# EAGLE schematic PumpMonitoring (EAGLE 7.6.0)
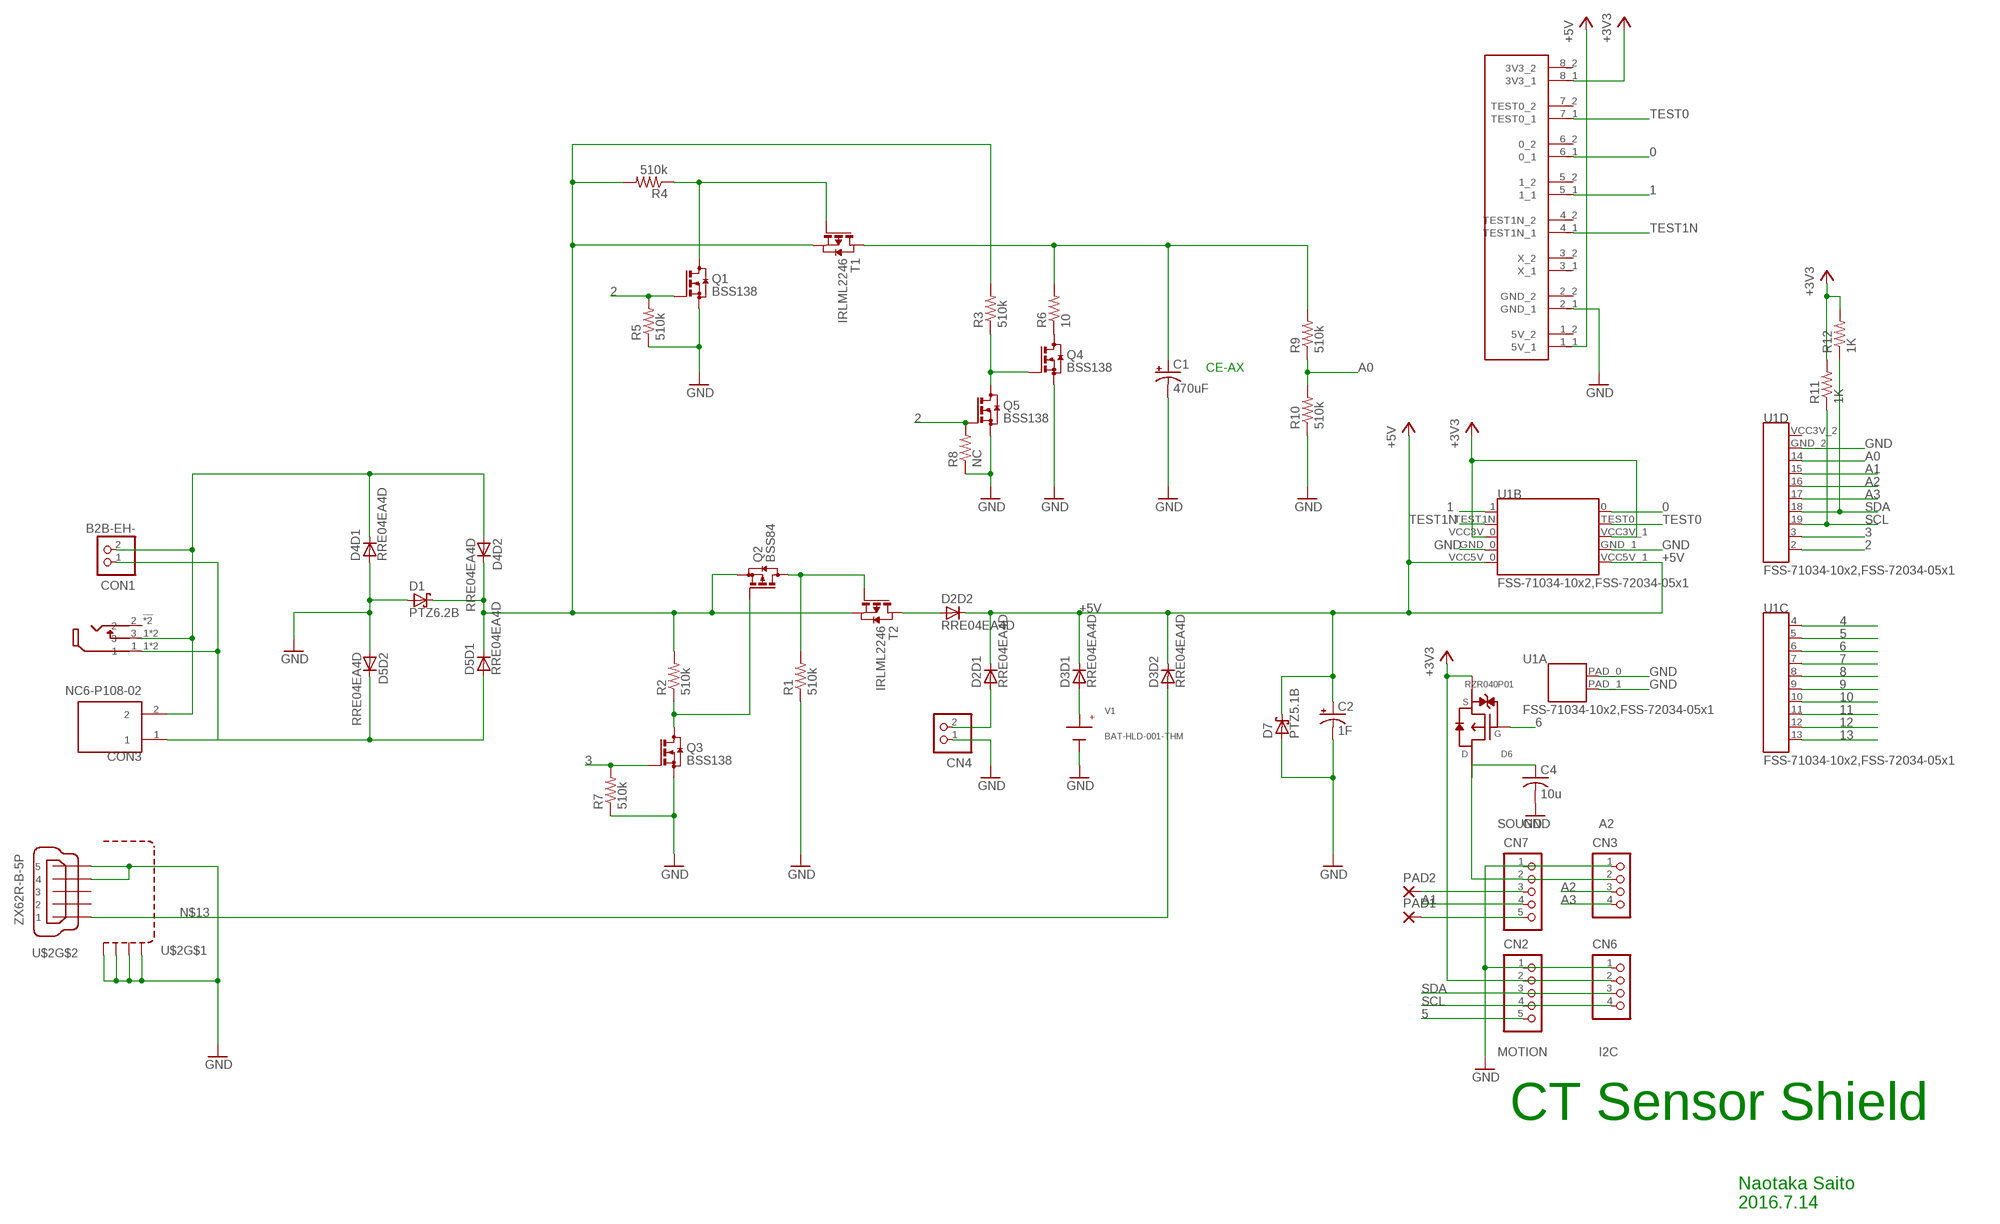
[diagram p0: schematic, sheet 1]

## Parts
C1  470uF  CPOL-USE5-10.5  [E5-10,5]
C2  1F  CPOL-USE5-20  [E5-20]
C4  10u  C-USC1206  [C1206]
CN2  B5B-PH-K-S  [B5B-PH-K-S]
CN3  B4B-PH-K-S  [B4B-PH-K-S]
CN4  B2B-PH-K-S  [B2B-PH-K-S]
CN6  B4B-PH-K-S  [B4B-PH-K-S]
CN7  B5B-PH-K-S  [B5B-PH-K-S]
CON1  B2B-EH-  [B2B-EH]
CON2  MJ-3536N  [MJ-3536N]
CON3  NC6-P108-02  TE-NC6-P108-02  [2PIN]
D1  PTZ6.2B  PTZXXB  [DO214AC]
D2  RRE04EA4D  [TSMD5]
D3  RRE04EA4D  [TSMD5]
D4  RRE04EA4D  [TSMD5]
D5  RRE04EA4D  [TSMD5]
D6  RZR040P01  [TSMT3]
D7  PTZ5.1B  PTZXXB  [DO214AC]
PAD1  1,6/0,9  [1,6/0,9]
PAD2  1,6/0,9  [1,6/0,9]
Q1  BSS138  BSS123  [SOT23]
Q2  BSS84  [SOT23]
Q3  BSS138  BSS123  [SOT23]
Q4  BSS138  BSS123  [SOT23]
Q5  BSS138  BSS123  [SOT23]
R1  510k  R-US_R0603  [R0603]
R2  510k  R-US_R0603  [R0603]
R3  510k  R-US_R0603  [R0603]
R4  510k  R-US_R0603  [R0603]
R5  510k  R-US_R0603  [R0603]
R6  10  MCR18  [EZP]
R7  510k  R-US_R0603  [R0603]
R8  NC  R-US_R0603  [R0603]
R9  510k  R-US_R0603  [R0603]
R10  510k  R-US_R0603  [R0603]
R11  1K  R-US_R0603  [R0603]
R12  1K  R-US_R0603  [R0603]
T1  IRLML2246  PMOSSOT23  [SOT-23]
T2  IRLML2246  PMOSSOT23  [SOT-23]
U1  FSS-71034-10x2,FSS-72034-05x1  LAZURITE920JLAZURITE920J  [LAZURITE920J]
U$1  XB-1-X  [XB-1-X]
U$2  ZX62R-B-5P  MICRO-USB-SHIELD-ZX62R-B-5P  [ZX62R-B-5P]
V1  BAT-HLD-001-THM  [CR2032]

## Nets
0: U1.0 U$1.6_1(0_1)
1: U1.1 U$1.5_1(1_1)
2: Q1.1(G) Q5.1(G) R5.2 R8.2 U1.2
3: Q3.1(G) R7.2 U1.3
4: U1.4
5: CN2.5 U1.5
6: D6.1(G) U1.6
7: U1.7
8: U1.8
9: U1.9
10: U1.10
11: U1.11
12: U1.12
13: U1.13
+3V3: CN2.2 CN6.2 D6.2(S) R11.2 R12.2 U1.VCC3V_0(B:VCC3V_0) U1.VCC3V_1(B:VCC3V_1) U$1.8_1(3V3_1)
+5V: C2.+ D2.4(D2:C) D2.5(D1:C) D3.4(D2:C) D3.5(D1:C) D7.C U1.VCC5V_0(B:VCC5V_0) U1.VCC5V_1(B:VCC5V_1) U$1.1_1(5V_1)
A0: R9.1 R10.2 U1.14
A1: CN7.4 U1.15
A2: CN3.3 U1.16
A3: CN3.4 U1.17
GND: C1.- C2.- C4.2 CN2.1 CN3.1 CN4.1 CN6.1 CN7.1 D1.A D4.1(D1:A) D5.3(D2:A) D7.A Q1.2(S) Q3.2(S) Q4.2(S) Q5.2(S) R1.1 R5.1 R7.1 R8.1 R10.1 U1.GND_0(B:GND_0) U1.GND_1(B:GND_1) U1.GND_2(D:GND_2) U1.PAD_0(A:PAD_0) U1.PAD_1(A:PAD_1) U$1.2_1(GND_1) U$2.4 U$2.5 U$2.M1(S1) U$2.M2(S2) U$2.M3(S3) U$2.M4(S4) V1.GND
I+: CON1.2 CON2.3_1 CON2.3_2 CON3.2 D4.3(D2:A) D4.5(D1:C)
I-: CON1.1 CON2.1_1 CON2.1_2 CON3.1 D5.1(D1:A) D5.4(D2:C)
IOUT: D1.C D4.4(D2:C) D5.5(D1:C) Q2.2(S) R2.2 R3.2 R4.2 T1.2(S) T2.2(S)
N$1: Q2.3(D) R1.2 T2.3(G)
N$2: D3.1(D1:A) V1.VDD1(VDD) V1.VDD2(VDD) V1.VDD3(VDD) V1.VDD4(VDD)
N$3: CN4.2 D2.1(D1:A)
N$4: C4.1 CN3.2 CN7.2 D6.3(D)
N$5: Q2.1(G) Q3.3(D) R2.1
N$6: CN7.5 PAD1.1(P)
N$7: Q1.3(D) R4.1 T1.3(G)
N$8: CN7.3 PAD2.1(P)
N$9: Q4.3(D) R6.1
N$10: C1.+ R6.2 R9.2 T1.1(D)
N$11: Q4.1(G) Q5.3(D) R3.1
N$12: D2.3(D2:A) T2.1(D)
N$13: D3.3(D2:A) U$2.1
SCL: CN2.4 CN6.4 R11.1 U1.19
SDA: CN2.3 CN6.3 R12.1 U1.18
TEST0: U1.TEST0(B:TEST0) U$1.7_1(TEST0_1)
TEST1N: U1.TEST1N(B:TEST1N) U$1.4_1(TEST1N_1)
Unconnected: CON2.2_2 CON2.2_! U1.VCC3V_2(D:VCC3V_2) U$1.1_2(5V_2) U$1.2_2(GND_2) U$1.3_1(X_1) U$1.3_2(X_2) U$1.4_2(TEST1N_2) U$1.5_2(1_2) U$1.6_2(0_2) U$1.7_2(TEST0_2) U$1.8_2(3V3_2) U$2.2 U$2.3

## Notes on the sheet
- CE-AX
- SOUND | A2
- MOTION | I2C
- CT Sensor Shield
- Naotaka Saito
  2016.7.14

## Library data of the parts
C1 C2 = rcl:CPOL-US: POLARIZED CAPACITOR, American symbol
C4 = rcl:C-US: CAPACITOR, American symbol
CN2 CN7 = jst-ph:B5B-PH-*: Wire-to-Board 2.0mm pitch top mount connector Source: http://www.jst-mfg.com/product/pdf/jpn/PH.pdf http://www.jst-mfg.com/product/detail.php?series=199
CN3 CN6 = jst-ph:B4B-PH-*: Wire-to-Board 2.0mm pitch top mount connector Source: http://www.jst-mfg.com/product/pdf/jpn/PH.pdf http://www.jst-mfg.com/product/detail.php?series=199
CN4 = jst-ph:B2B-PH-*: Wire-to-Board 2.0mm pitch top mount connector Source: http://www.jst-mfg.com/product/pdf/jpn/PH.pdf http://www.jst-mfg.com/product/detail.php?series=199
CON1 = jst-ph:B2B-EH-*
CON2 = mouser:MJ-3536N: Mouser 部品番号： 490-MJ-3536N メーカ部品番号：MJ-3536N メーカ: CUI 詳細：フォーンコネクタ Audio Jacks URL: click <http://www.mouser.jp/ProductDetail/CUI/MJ-3536N/?qs=sGAEpiMZZMv0W4pxf2HiVz9SCMkER55fgU4mAJR6d6TaQPgwlv6tnA%3d%3d>
CON3 = lz-shield:TE-NC6-P108-02: TE-Connectivity-AMP-Connectors NC6-P108-02 http://www.digikey.jp/product-detail/ja/te-connectivity-amp-connectors/NC6-P108-02/A98495-ND/1277926
D1 D7 = rohm2:PTZXXB
D2-D5 = rohm2:RRE04EA4D
D6 = rohm2:RZR040P01
PAD1 PAD2 = wirepad:1,6/0,9: THROUGH-HOLE PAD
Q1 Q3-Q5 = transistor-small-signal:BSS123: N-CHANNEL MOS FET
Q2 = transistor-small-signal:BSS84: P-CHANNEL MOS FET
R1-R5 R7-R12 = resistor:R-US_: RESISTOR, American symbol
R6 = rohm2:MCR18
T1 T2 = zetex:PMOSSOT23: MOS FET; OC_FARNELL: unknown; OC_NEWARK: unknown
U1 = lazurite:LAZURITE920J: Lazurite 920J HIROSUGI PSS-710103-10 1.27pitch 1x10pin pin header x 2pcs HIROSUGI PSS-720102-05 1.27pitch 2x5pin pin header
U$1 = lz-shield:XB-1-X
U$2 = con-hirose:MICRO-USB-SHIELD-: Hirose Micro USB Connector ZX62R-B-5P: Micro B, reverse (top mount) shell SMT Supplier: DigiKey H11574CT-ND Source: http://www.hirose.co.jp/cataloge_hp/e24200011.pdf
V1 = mouser:BAT-HLD-001-THM: Mouser 部品番号：712-BAT-HLD-001-THM メーカ部品番号：BAT-HLD-001-THM